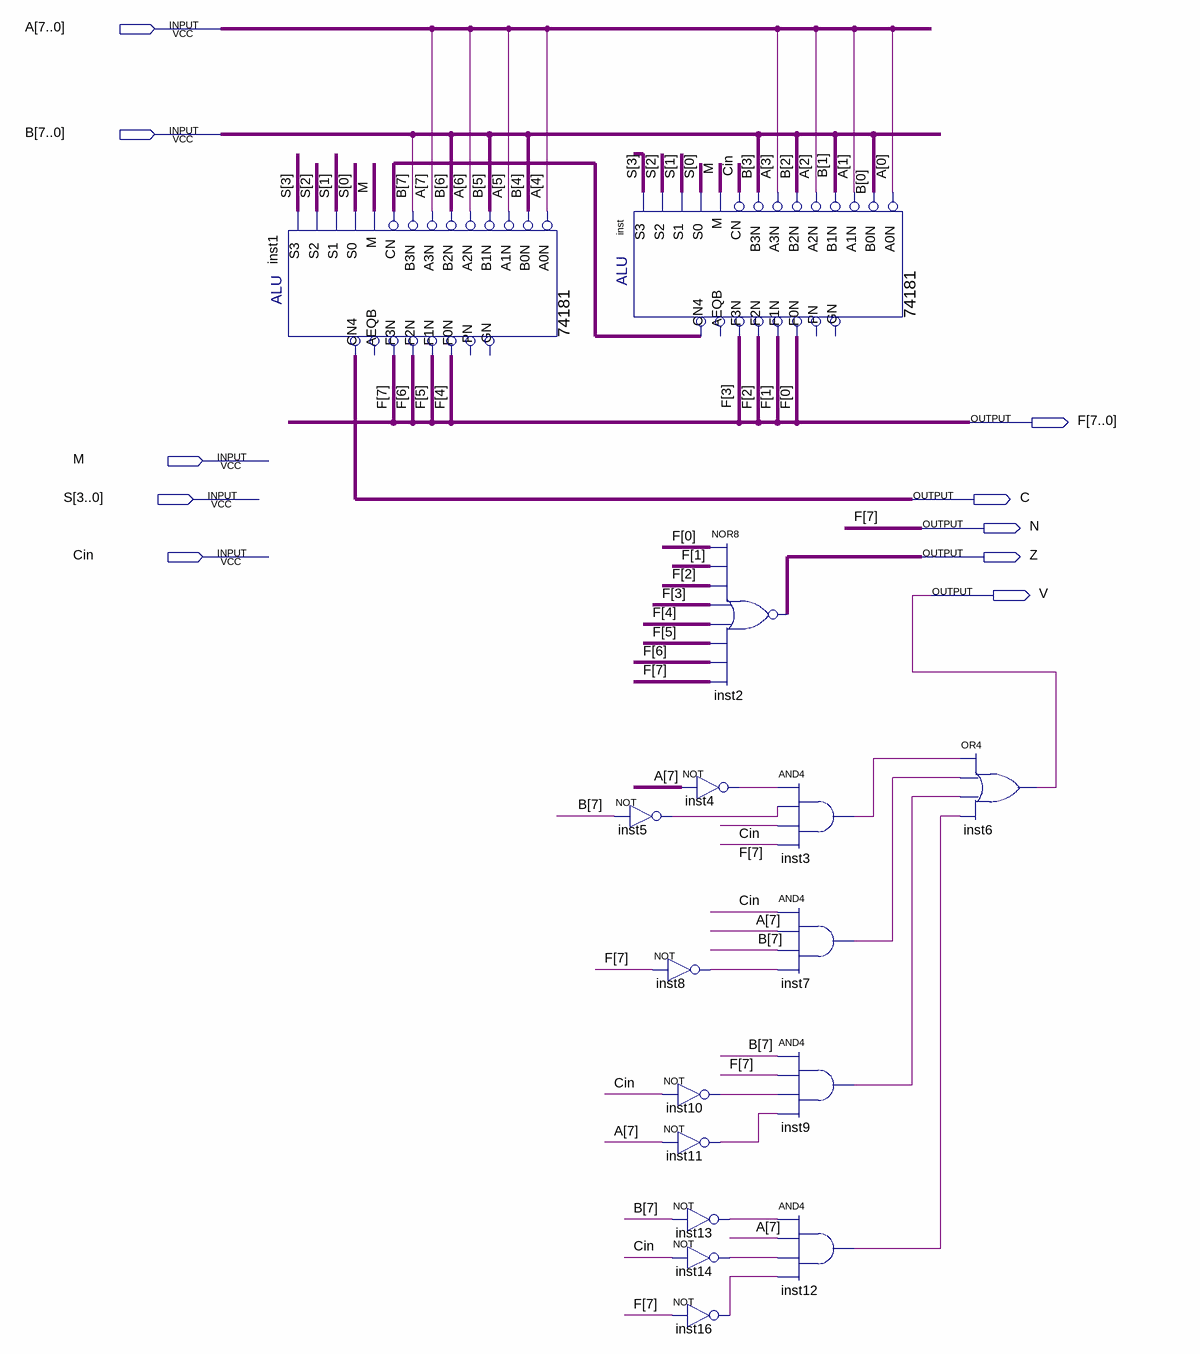
[diagram p0: schematic sheet]
// Quartus schematic ALU8bits.bdf as structural Verilog: 16 symbols, 10 pins
module ALU8bits (
  input  [7:0] A,
  input  [7:0] B,
  input  M,
  input  [3:0] S,
  input  Cin,
  output [7:0] F,
  output C,
  output N,
  output Z,
  output V
);

  wire inst3_out, inst4_out, inst5_out, inst7_out, inst8_out, inst9_out, inst10_out, inst11_out, inst12_out,
       inst13_out, inst14_out, inst16_out, inst_cn4;

  \74181  inst1 (
    .B0N(B[4]), .A0N(A[4]), .A1N(A[5]), .B1N(B[5]), .A3N(A[7]), .B2N(B[6]), .A2N(A[6]), .M(M), .CN(inst_cn4),
    .B3N(B[7]), .S2(S[2]), .S1(S[1]), .S0(S[0]), .S3(S[3]), .F3N(F[7]), .F1N(F[5]), .F0N(F[4]), .CN4(C),
    .F2N(F[6]));  // open: PN, GN, AEQB
  \74181  inst (
    .B0N(B[0]), .A0N(A[0]), .A1N(A[1]), .B1N(B[1]), .A3N(A[3]), .B2N(B[2]), .A2N(A[2]), .M(M), .CN(Cin),
    .B3N(B[3]), .S2(S[2]), .S1(S[1]), .S0(S[0]), .S3(S[3]), .F3N(F[3]), .F1N(F[1]), .F0N(F[0]),
    .CN4(inst_cn4), .F2N(F[2]));  // open: PN, GN, AEQB
  not inst5 (inst5_out, B[7]);
  not inst8 (inst8_out, F[7]);
  not inst10 (inst10_out, Cin);
  not inst11 (inst11_out, A[7]);
  nor inst2 (Z, F[0], F[1], F[2], F[3], F[4], F[5], F[6], F[7]);
  not inst4 (inst4_out, A[7]);
  not inst13 (inst13_out, B[7]);
  not inst14 (inst14_out, Cin);
  not inst16 (inst16_out, F[7]);
  and inst3 (inst3_out, inst4_out, inst5_out, Cin, F[7]);
  and inst7 (inst7_out, Cin, A[7], B[7], inst8_out);
  and inst9 (inst9_out, B[7], F[7], inst10_out, inst11_out);
  and inst12 (inst12_out, inst13_out, A[7], inst14_out, inst16_out);
  or inst6 (V, inst3_out, inst7_out, inst9_out, inst12_out);

  assign N = F[7];
endmodule
